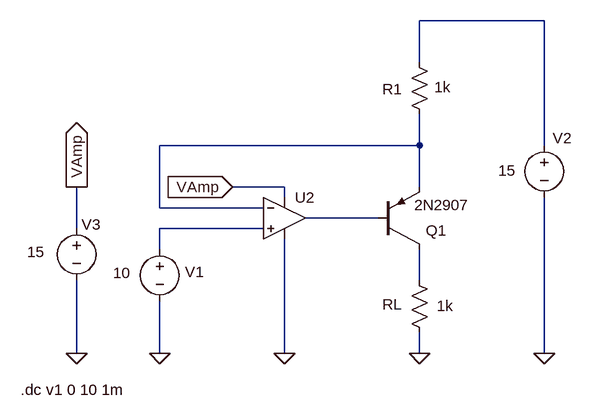
[diagram p0: schematic Draft2.asc]
Draft2.asc, the LTspice schematic file:
Version 4
SHEET 1 1188 680
WIRE 896 -192 704 -192
WIRE 704 -128 704 -192
WIRE 704 0 704 -48
WIRE 704 0 304 0
WIRE 896 0 896 -192
WIRE 496 64 416 64
WIRE 704 64 704 0
WIRE 496 80 496 64
WIRE 304 96 304 0
WIRE 464 96 304 96
WIRE 640 112 528 112
WIRE 176 128 176 64
WIRE 464 128 304 128
WIRE 304 160 304 128
WIRE 704 208 704 160
WIRE 176 320 176 208
WIRE 304 320 304 240
WIRE 496 320 496 144
WIRE 704 320 704 288
WIRE 896 320 896 80
FLAG 304 320 0
FLAG 176 320 0
FLAG 176 64 VAmp
IOPIN 176 64 Out
FLAG 704 320 0
FLAG 896 320 0
FLAG 496 320 0
FLAG 416 64 VAmp
IOPIN 416 64 In
SYMBOL voltage 176 112 R0
WINDOW 0 8 10 Left 2
WINDOW 3 -76 52 Left 2
WINDOW 123 0 0 Left 2
WINDOW 39 0 0 Left 2
SYMATTR InstName V3
SYMATTR Value 15
SYMBOL voltage 304 144 R0
WINDOW 0 39 51 Left 2
WINDOW 3 -72 52 Left 2
SYMATTR InstName V1
SYMATTR Value 10
SYMBOL pnp 640 160 M180
WINDOW 0 74 29 Left 2
WINDOW 3 56 68 Left 2
SYMATTR InstName Q1
SYMATTR Value 2N2907
SYMBOL res 688 -144 R0
WINDOW 0 -41 57 Left 2
WINDOW 3 39 54 Left 2
SYMATTR InstName R1
SYMATTR Value 1k
SYMBOL res 688 192 R0
WINDOW 0 -41 53 Left 2
WINDOW 3 43 55 Left 2
SYMATTR InstName RL
SYMATTR Value 1k
SYMBOL voltage 896 -16 R0
WINDOW 0 13 5 Left 2
WINDOW 3 -71 55 Left 2
SYMATTR InstName V2
SYMATTR Value 15
SYMBOL Opamps\\UniversalOpamp2 496 112 R0
SYMATTR InstName U2
TEXT 90 376 Left 2 !.dc v1 0 10 1m

The netlist it stands for:
* Draft2.asc
V3 VAmp 0 15
V1 N004 0 10
Q1 N005 N003 N002 0 2N2907
R1 N001 N002 1k
RL N005 0 1k
V2 N001 0 15
XU2 N004 N002 VAmp 0 N003 level.2 Avol=1Meg GBW=10Meg Slew=10Meg ilimit=25m rail=0 Vos=0 phimargin=45 en=0 enk=0 in=0 ink=0 Rin=500Meg  ; pins IN+ IN- V+ V- OUT
.model NPN NPN
.model PNP PNP
.lib standard.bjt
.dc v1 0 10 1m
.lib UniversalOpamps2.sub
.backanno
.end

* Results of the author's LTspice run, read from the files saved beside the schematic
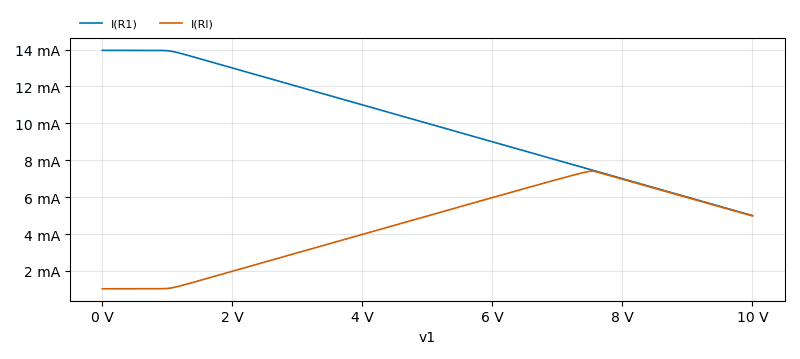
[diagram p1: DC transfer characteristic of Draft2.asc, plotted from the saved traces]
* DC transfer characteristic, 1 run:
*   I(R1): 13.95 mA at v1=0 V, 5 mA at v1=10 V, min 5 mA, max 13.95 mA
*   I(Rl): 1.034 mA at v1=0 V, 4.98 mA at v1=10 V, min 1.034 mA, max 7.41 mA